# Altium schematic sheet 4.CAMERA-RGB.SchDoc: MC-IMX6UL-CORE
size A4; DrawnBy: DrawnBy; DocumentNumber: MC-IMX6UL-CORE; Revision: V1.1; SheetNumber: 4 of 9
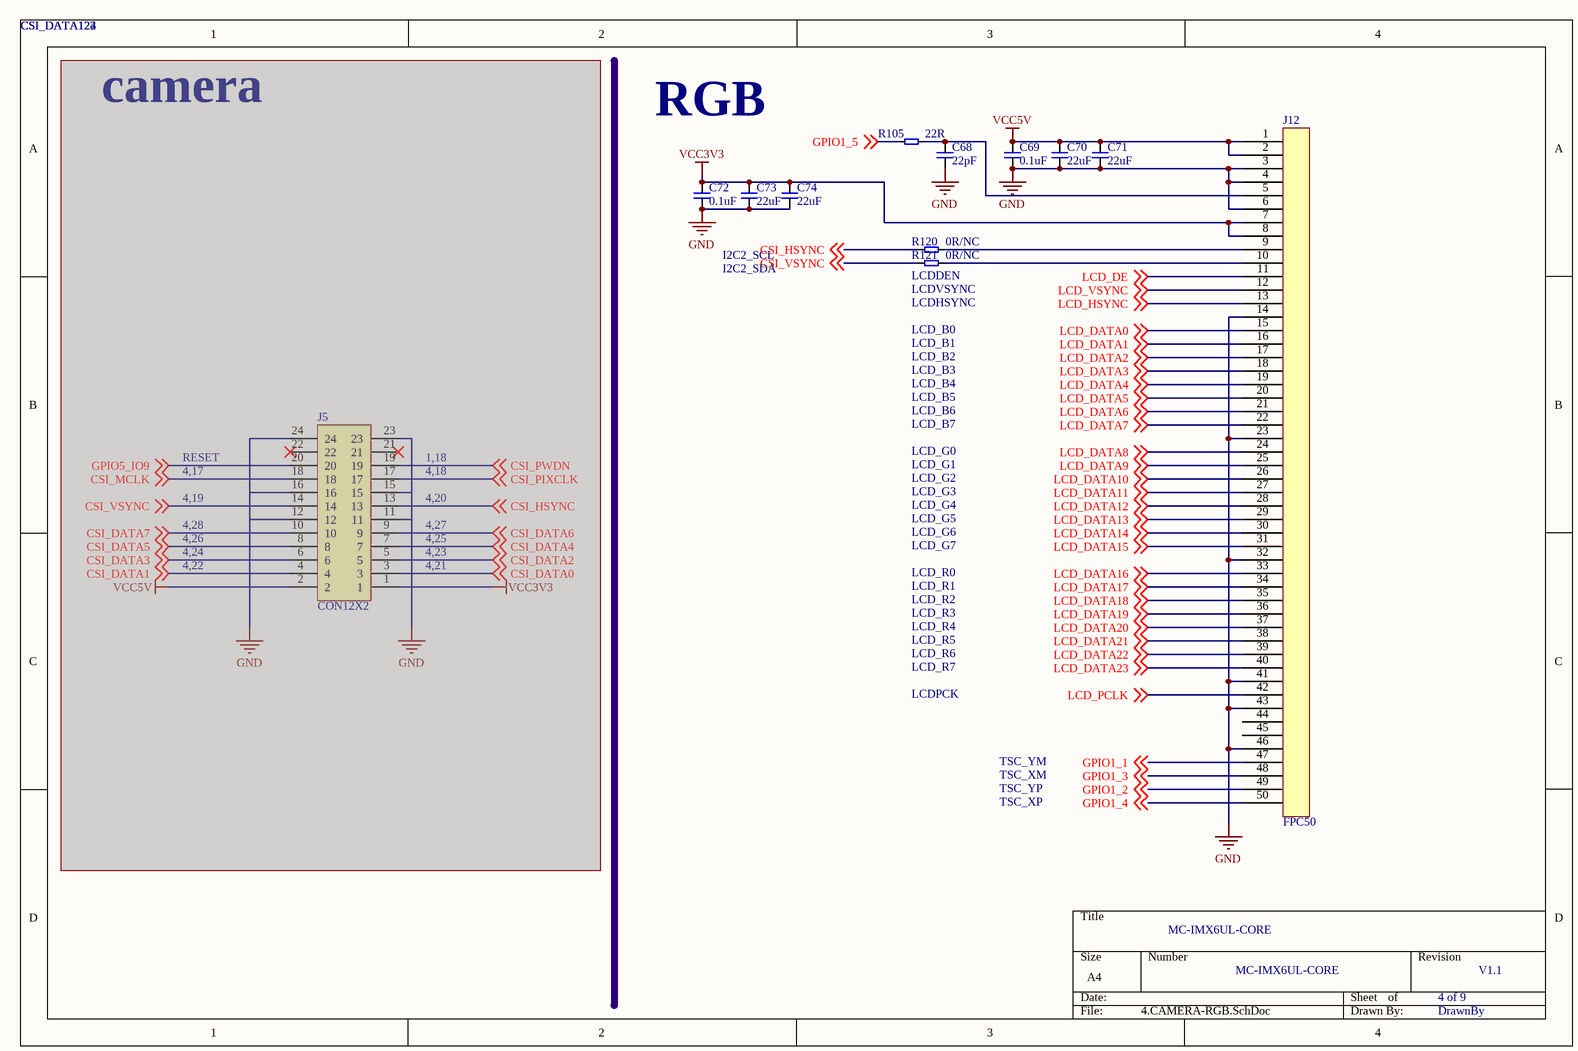
[diagram p0: 4.CAMERA-RGB.SchDoc]

## Parts
C68  22pF  [0603C]
C69  0.1uF  [0603C]
C70  22uF  [0805C]
C71  22uF  [0805C]
C72  0.1uF  [0603C]
C73  22uF  [0805C]
C74  22uF  [0805C]
J5  CON12X2  [IDC12X2-2.54MM]  (masked out: inside a compile mask, not in the netlist)
J12  FPC50  [FPC50-0.5-UP]
R105  22R  [0603R]
R120  0R/NC  [0603R]
R121  0R/NC  [0603R]

## Nets
GND: C68.2 C69.2 C70.1 C71.1 C72.2 C73.1 C74.1 J12.3 J12.4 J12.6 J12.14 J12.23 J12.32 J12.41 J12.43 J12.46
VCC3V3: C72.1 C73.2 C74.2 J12.7 J12.8
VCC5V: C69.1 C70.2 C71.2 J12.1 J12.2
CSI_HSYNC: R120.2 ; off-sheet CSI_HSYNC
CSI_VSYNC: R121.2 ; off-sheet CSI_VSYNC
GPIO1_1: J12.47 ; off-sheet GPIO1_1
GPIO1_2: J12.49 ; off-sheet GPIO1_2
GPIO1_3: J12.48 ; off-sheet GPIO1_3
GPIO1_4: J12.50 ; off-sheet GPIO1_4
GPIO1_5: R105.1 ; off-sheet GPIO1_5
LCD_DATA0: J12.15 ; off-sheet LCD_DATA0
LCD_DATA1: J12.16 ; off-sheet LCD_DATA1
LCD_DATA2: J12.17 ; off-sheet LCD_DATA2
LCD_DATA3: J12.18 ; off-sheet LCD_DATA3
LCD_DATA4: J12.19 ; off-sheet LCD_DATA4
LCD_DATA5: J12.20 ; off-sheet LCD_DATA5
LCD_DATA6: J12.21 ; off-sheet LCD_DATA6
LCD_DATA7: J12.22 ; off-sheet LCD_DATA7
LCD_DATA8: J12.24 ; off-sheet LCD_DATA8
LCD_DATA9: J12.25 ; off-sheet LCD_DATA9
LCD_DATA10: J12.26 ; off-sheet LCD_DATA10
LCD_DATA11: J12.27 ; off-sheet LCD_DATA11
LCD_DATA12: J12.28 ; off-sheet LCD_DATA12
LCD_DATA13: J12.29 ; off-sheet LCD_DATA13
LCD_DATA14: J12.30 ; off-sheet LCD_DATA14
LCD_DATA15: J12.31 ; off-sheet LCD_DATA15
LCD_DATA16: J12.33 ; off-sheet LCD_DATA16
LCD_DATA17: J12.34 ; off-sheet LCD_DATA17
LCD_DATA18: J12.35 ; off-sheet LCD_DATA18
LCD_DATA19: J12.36 ; off-sheet LCD_DATA19
LCD_DATA20: J12.37 ; off-sheet LCD_DATA20
LCD_DATA21: J12.38 ; off-sheet LCD_DATA21
LCD_DATA22: J12.39 ; off-sheet LCD_DATA22
LCD_DATA23: J12.40 ; off-sheet LCD_DATA23
LCD_DE: J12.11 ; off-sheet LCD_DE
LCD_HSYNC: J12.13 ; off-sheet LCD_HSYNC
LCD_PCLK: J12.42 ; off-sheet LCD_PCLK
LCD_VSYNC: J12.12 ; off-sheet LCD_VSYNC
NetC68_1: C68.1 J12.5 R105.2
NetJ12_9: J12.9 R120.1
NetJ12_10: J12.10 R121.1

Not connected (* = marked no-connect by the designer): J12 44 45

## Notes on the sheet
- CSI_DATA122
- CSI_DATA123
- CSI_DATA124
- camera
- RGB
- I2C2_SCL
- I2C2_SDA
- (near R121) LCDDEN
- LCDVSYNC
- LCDHSYNC
- LCD_B0
- LCD_B1
- LCD_B2
- LCD_B3
- LCD_B4
- LCD_B5
- RESET
- 1,18
- LCD_G0
- LCD_B6
- LCD_B7
- 4,17
- 4,19
- 4,28
- 4,20
- 4,18
- 4,27
- LCD_G1
- LCD_G2
- LCD_G3
- LCD_G4
- LCD_G5
- LCD_G6
- 4,22
- 4,24
- 4,26
- 4,21
- 4,23
- 4,25
- LCD_R0
- LCD_R1
- LCD_G7
- LCD_R2
- LCD_R3
- LCD_R4
- LCD_R5
- LCD_R6
- LCD_R7
- LCDPCK
- TSC_YM
- TSC_XM
- TSC_YP
- TSC_XP

## Library data of the parts
C68-C74 = 电容
J12 = FPC50: FPC CONNECTOR
R105 R120 R121 = 电阻